# Altium schematic sheet IO.SchDoc
size B; SheetNumber: 2; SheetTotal: 4
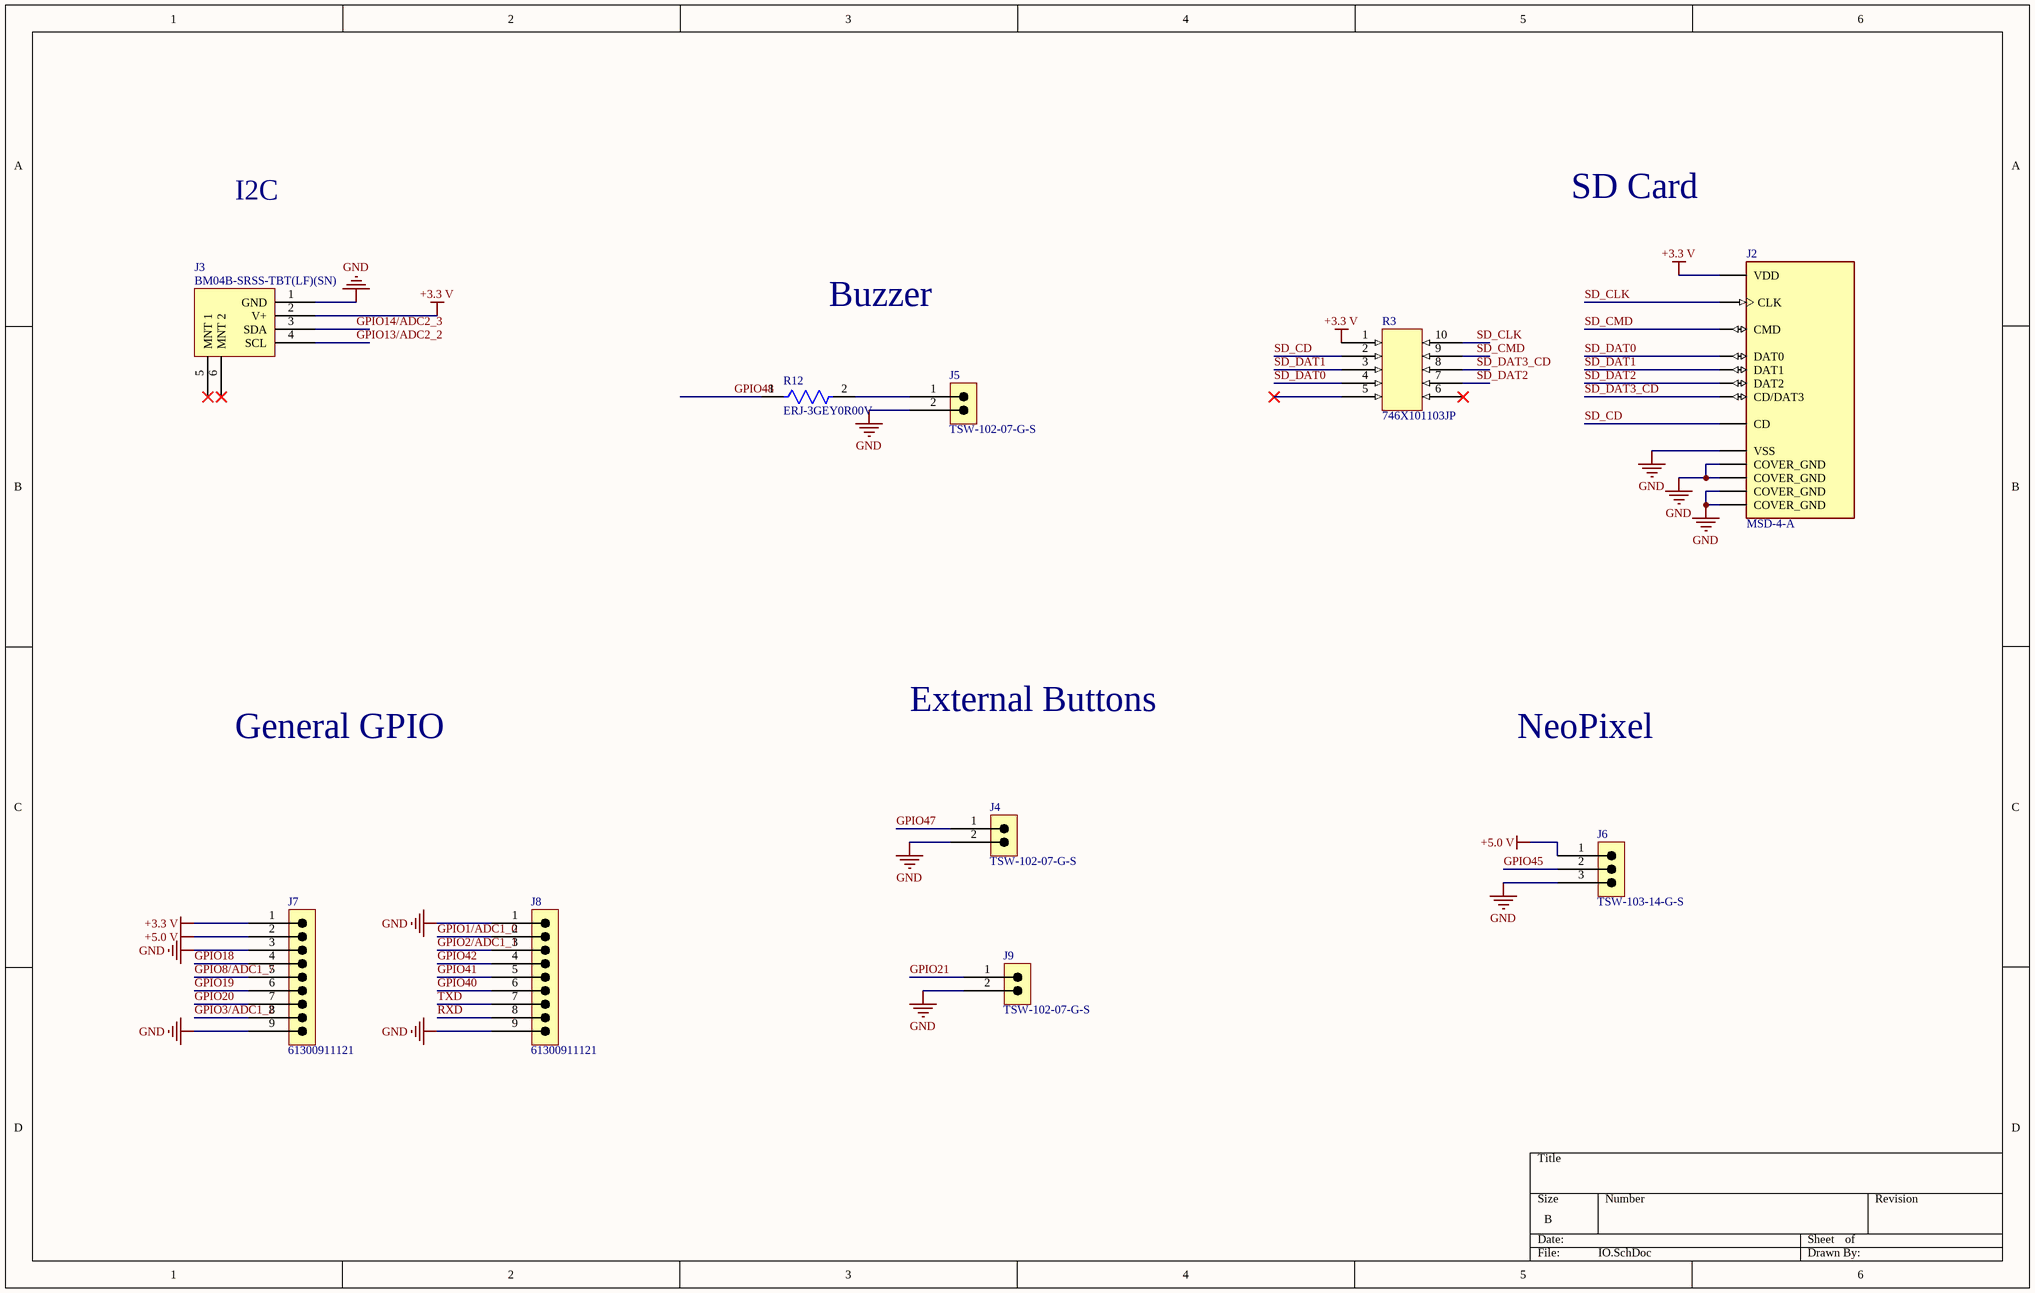
[diagram p0: IO.SchDoc]

## Parts
J2  MSD-4-A  [CUI_MSD-4-A]
J3  BM04B-SRSS-TBT(LF)(SN)  [FP-BM04B-SRSS-TBT_LF_SN-MFG]
J4  TSW-102-07-G-S  [FP-TSW-102-07-G-S-MFG]
J5  TSW-102-07-G-S  [FP-TSW-102-07-G-S-MFG]
J6  TSW-103-14-G-S  [FP-TSW-103-14-G-S-MFG]
J7  61300911121  [61300911121]
J8  61300911121  [61300911121]
J9  TSW-102-07-G-S  [FP-TSW-102-07-G-S-MFG]
R3  746X101103JP  [CAF-127P640X310-10N]
R12  ERJ-3GEY0R00V  [FP-ERJ-3GEY0R00V-IPC_A]

## Nets
+3.3 V: J2.4(VDD) J3.2(V+) J7.1 R3.1
+5.0 V: J6.1 J7.2
GND: J2.6(VSS) J2.G1(COVER_GND) J2.G2(COVER_GND) J2.G3(COVER_GND) J2.G4(COVER_GND) J3.1(GND) J4.2 J5.2 J6.3 J7.3 J7.9 J8.1 J8.9 J9.2
GPIO1/ADC1_0: J8.2
GPIO2/ADC1_1: J8.3
GPIO3/ADC1_2: J7.8
GPIO8/ADC1_7: J7.5
GPIO13/ADC2_2: J3.4(SCL)
GPIO14/ADC2_3: J3.3(SDA)
GPIO18: J7.4
GPIO19: J7.6
GPIO20: J7.7
GPIO21: J9.1
GPIO40: J8.6
GPIO41: J8.5
GPIO42: J8.4
GPIO45: J6.2
GPIO47: J4.1
GPIO48: R12.1
RXD: J8.8
SD_CD: J2.CD R3.2
SD_CLK: J2.5(CLK) R3.10
SD_CMD: J2.3(CMD) R3.9
SD_DAT0: J2.7(DAT0) R3.4
SD_DAT1: J2.8(DAT1) R3.3
SD_DAT2: J2.1(DAT2) R3.7
SD_DAT3_CD: J2.2(CD/DAT3) R3.8
TXD: J8.7
NetJ5_1: J5.1 R12.2

Not connected (* = marked no-connect by the designer): J3 5(MNT_1)* 6(MNT_2)*; R3 5* 6*

## Notes on the sheet
- I2C
- SD Card
- Buzzer
- General GPIO
- External Buttons
- NeoPixel

## Library data of the parts
J2 = CMP-002-00078-2: Micro SD Card Connector, 9 Positions, Connector and Ejector, Push In, Auto Eject Out, Surface Mount, 1.8 mm Height Above Board, Gold Flash; MF: CUI Devices; Source: MSD-4-A.SchLib; CUI_purchase_URL: https://www.cuidevices.com/product/interconnect/connectors/memory-card-connectors/sd-card-connectors/msd-4-a?utm_source=snapeda.com&utm_medium=referral&utm_campaign=snapedaBOM; Component Type: Standard; Value: *; Case/Package: None; SnapEDA_Link: https://www.snapeda.com/parts/MSD-4-A/CUI+Devices/view-part/?ref=snap; Pins: 13; MP: MSD-4-A; Check_prices: https://www.snapeda.com/parts/MSD-4-A/CUI+Devices/view-part/?ref=eda; Design Item ID: MSD-4-A
J3 = CMP-002-00076-4: 1.0mm Pitch, Ultra-Compact, Low Profile Design, Interchangeable Shrouded Header
J4 J5 J9 = CMP-00020-2: Board Connector, 2 Contact(s), 1 Row(s), Male, Straight, 0.1 inch Pitch, Solder Terminal, Black Insulator; Additional Feature: E.L.P.; Mixed Contacts: No; Plating Thickness: 10uin; Reliability: COMMERCIAL; Number of Rows Loaded: 1; Option: General Purpose; Number of Contacts: 2; Body/Shell Style: RECEPTACLE; PCB Contact Pattern: RECTANGULAR; Contact Style: SQ PIN-SKT; Mating Information: MULTIPLE MATING PARTS AVAILABLE; Reference Standard: UL; Mating Contact Pitch: 0.1inch; DIN Conformance: No; Terminal Length: 0.1inch; Flammability Rating: UL94 V-0; Body Depth: 0.1inch; Contact Finish - Termination: Gold (Au) - with Nickel (Ni) barrier; Body Breadth: 0.1inch; Reach SVHC Compliant: Yes; MIL Conformance: No; Contact Pattern: RECTANGULAR; Termination: Solder; Insulation Material: Glass; Insulation Color: Black; Terminal Pitch: 2.54mm; Filter Feature: No; Connector Type: BOARD CONNECTOR; Mounting Style: STRAIGHT; Contact Material: Bronze; Number Of Connectors: 1; Number Of PCB Rows: 1; IEC Conformance: No; Contact Finish - Mating: GOLD (10) OVER NICKEL (50); JESD-609 Code: e4; RoHS Compliant: Yes; Contact Gender: Male; Mounting Technology: Board
J6 = CMP-00025-3: Board Connector, 3 Contact(s), 1 Row(s), Male, Straight, 0.1 inch Pitch, Solder Terminal, Black Insulator, Receptacle; Additional Feature: E.L.P.; MIL Conformance: No; PCB Contact Pattern: RECTANGULAR; Mating Information: MULTIPLE MATING PARTS AVAILABLE; Number of Contacts: 3; Plating Thickness: 10uin; Reference Standard: UL; Reliability: COMMERCIAL; Contact Style: SQ PIN-SKT; Option: General Purpose; Number of Rows Loaded: 1; Contact Finish - Mating: GOLD (10) OVER NICKEL (50); Mounting Style: STRAIGHT; Reach SVHC Compliant: Yes; DIN Conformance: No; Filter Feature: No; Mixed Contacts: No; Body Depth: 0.1inch; Terminal Length: 0.11inch; Contact Pattern: RECTANGULAR; Contact Finish - Termination: Gold (Au) - with Nickel (Ni) barrier; Connector Type: BOARD CONNECTOR; Body Breadth: 0.1inch; Termination: Solder; Insulation Material: Glass; Body/Shell Style: RECEPTACLE; IEC Conformance: No; Insulation Color: Black; Contact Material: Bronze; RoHS Compliant: Yes; Mounting Technology: Board; Number Of Connectors: 1; Mating Contact Pitch: 0.1inch; JESD-609 Code: e4; Number Of PCB Rows: 1; Contact Gender: Male; Terminal Pitch: 2.54mm
J7 J8 = CMP-00023-4: Board Connector, 9 Contact(s), 1 Row(s), Male, Straight, 0.1 inch Pitch, Solder Terminal, Locking, Black Insulator, Plug; Rated Current (Signal): 3A; Body Length: 0.9inch; Reference Standard: UL; Reliability: COMMERCIAL; Contact Style: SQ PIN-SKT; PCB Contact Pattern: RECTANGULAR; Number of Contacts: 9; Insulation Resistance: 1GR; Dielectric Withstanding Voltage (AC): 500V; Number Of Connectors: 1; Contact Resistance: 20mR; Body/Shell Style: PLUG; Terminal Length: 0.118inch; Reach SVHC Compliant: Yes; Connector Type: BOARD CONNECTOR; Contact Finish - Termination: Gold (Au) - with Nickel (Ni) barrier; Body Depth: 0.1inch; Mounting Technology: Board; Terminal Pitch: 2.54mm; Body Breadth: 0.1inch; Max Operating Temperature: 125°C; Min Operating Temperature: -40°C; RoHS Compliant: Yes; Contact Material: Copper Alloy; Insulation Color: Black; Termination: Solder; Insulation Material: Polybutylene; Contact Finish - Mating: GOLD; Mounting Style: STRAIGHT; JESD-609 Code: e4; Mounting Option 1: LOCKING; Mating Contact Pitch: 0.1inch; Contact Pattern: RECTANGULAR; Number of Rows Loaded: 1; Contact Gender: Male
R3 = CMP-00038-1: Array/Network Resistor, Bussed, Metal Glaze/thick Film, 0.063W, 10000ohm, 25V, 5% +/-Tol, 200ppm/Cel, Surface Mount, 0612; Package Height: 0.6mm; Element Power Dissipation: 31mW; Value: 10kR; Package Length: 3.2mm; Number of Elements: 8; Package Width: 1.6mm; Rated Temperature: 70°C; Power: 248mW; Channels: 1; Temperature Coefficient: 200ppm/°C; Resistor Type: ARRAY/NETWORK RESISTOR; Working Voltage: 25V; RoHS Compliant: Yes; Min Operating Temperature: -55°C; Packaging: Tape and Reel; Package Style: SMTMeter; Case/Package: 0613; First Element Resistance: 10kR; Network Type: BUSSED; Package Shape: Rectangular; Reach SVHC Compliant: Yes; JESD-609 Code: e3; Pins: 10; Construction: Chip; Terminal Finish: Nickel; Mounting Technology: Surface Mount; Technology: METAL GLAZE/THICK FILM; Max Operating Temperature: 125°C; Termination: Wraparound; Tolerance: 5%
R12 = CMP-00039-1: Fixed Resistor, Metal Glaze/thick Film, 0.1W, 0ohm, Surface Mount, 0603; Reference Standard: AEC-Q200; Power: 100mW; Rated Temperature: 70°C; Value: 0R; Package Height: 0.45mm; Package Width: 0.8mm; Package Length: 1.6mm; Package Style: SMTMeter; Mounting Technology: Surface Mount; Construction: Rectangular; Case/Package: 0603; Packaging: Tape and Reel; Resistor Type: FIXED RESISTOR; Reach SVHC Compliant: Yes; JESD-609 Code: e3; Package Shape: Rectangular; Technology: METAL GLAZE/THICK FILM; Min Operating Temperature: -55°C; Max Operating Temperature: 155°C; Pins: 2; Termination: Wraparound; Terminal Finish: Nickel; RoHS Compliant: Yes